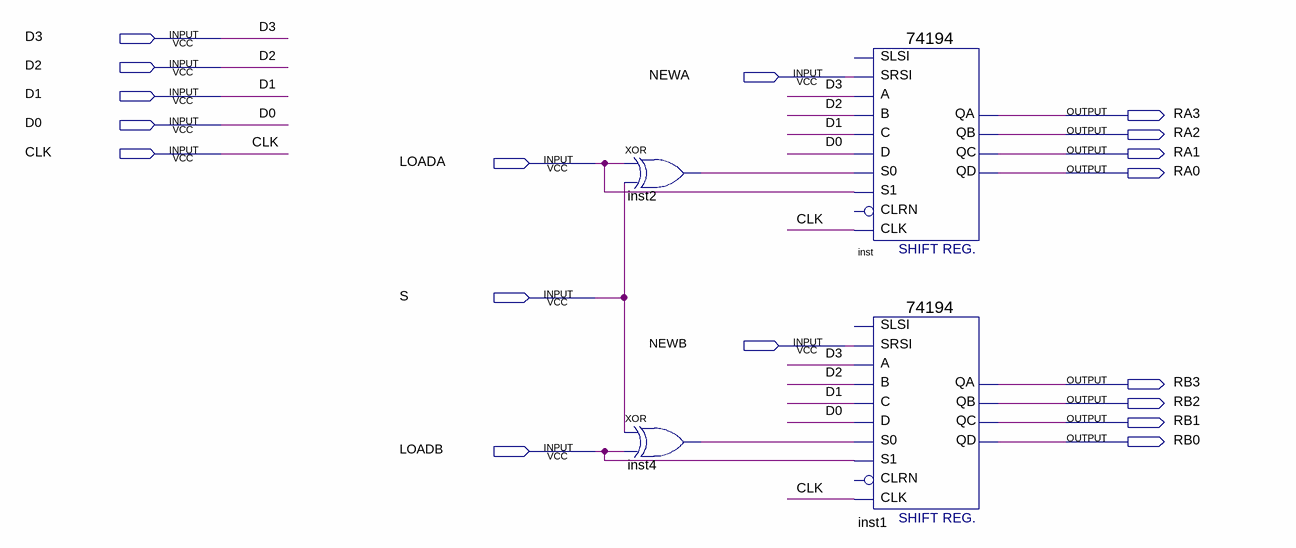
[diagram p0: schematic sheet]
// Quartus schematic storage_unit.bdf as structural Verilog: 4 symbols, 18 pins
module storage_unit (
  input  D3,
  input  D2,
  input  NEWA,
  input  D1,
  input  D0,
  input  CLK,
  input  LOADA,
  input  S,
  input  NEWB,
  input  LOADB,
  output RA3,
  output RA2,
  output RA1,
  output RA0,
  output RB3,
  output RB2,
  output RB1,
  output RB0
);

  wire inst2_out, inst4_out;

  xor inst2 (inst2_out, LOADA, S);
  xor inst4 (inst4_out, S, LOADB);
  \74194  inst (
    .SRSI(NEWA), .B(D2), .C(D1), .CLK(CLK), .D(D0), .S1(LOADA), .S0(inst2_out), .A(D3), .QA(RA3), .QB(RA2),
    .QC(RA1), .QD(RA0));  // open: SLSI, CLRN
  \74194  inst1 (
    .SRSI(NEWB), .B(D2), .C(D1), .CLK(CLK), .D(D0), .S1(LOADB), .S0(inst4_out), .A(D3), .QA(RB3), .QB(RB2),
    .QC(RB1), .QD(RB0));  // open: SLSI, CLRN
endmodule
